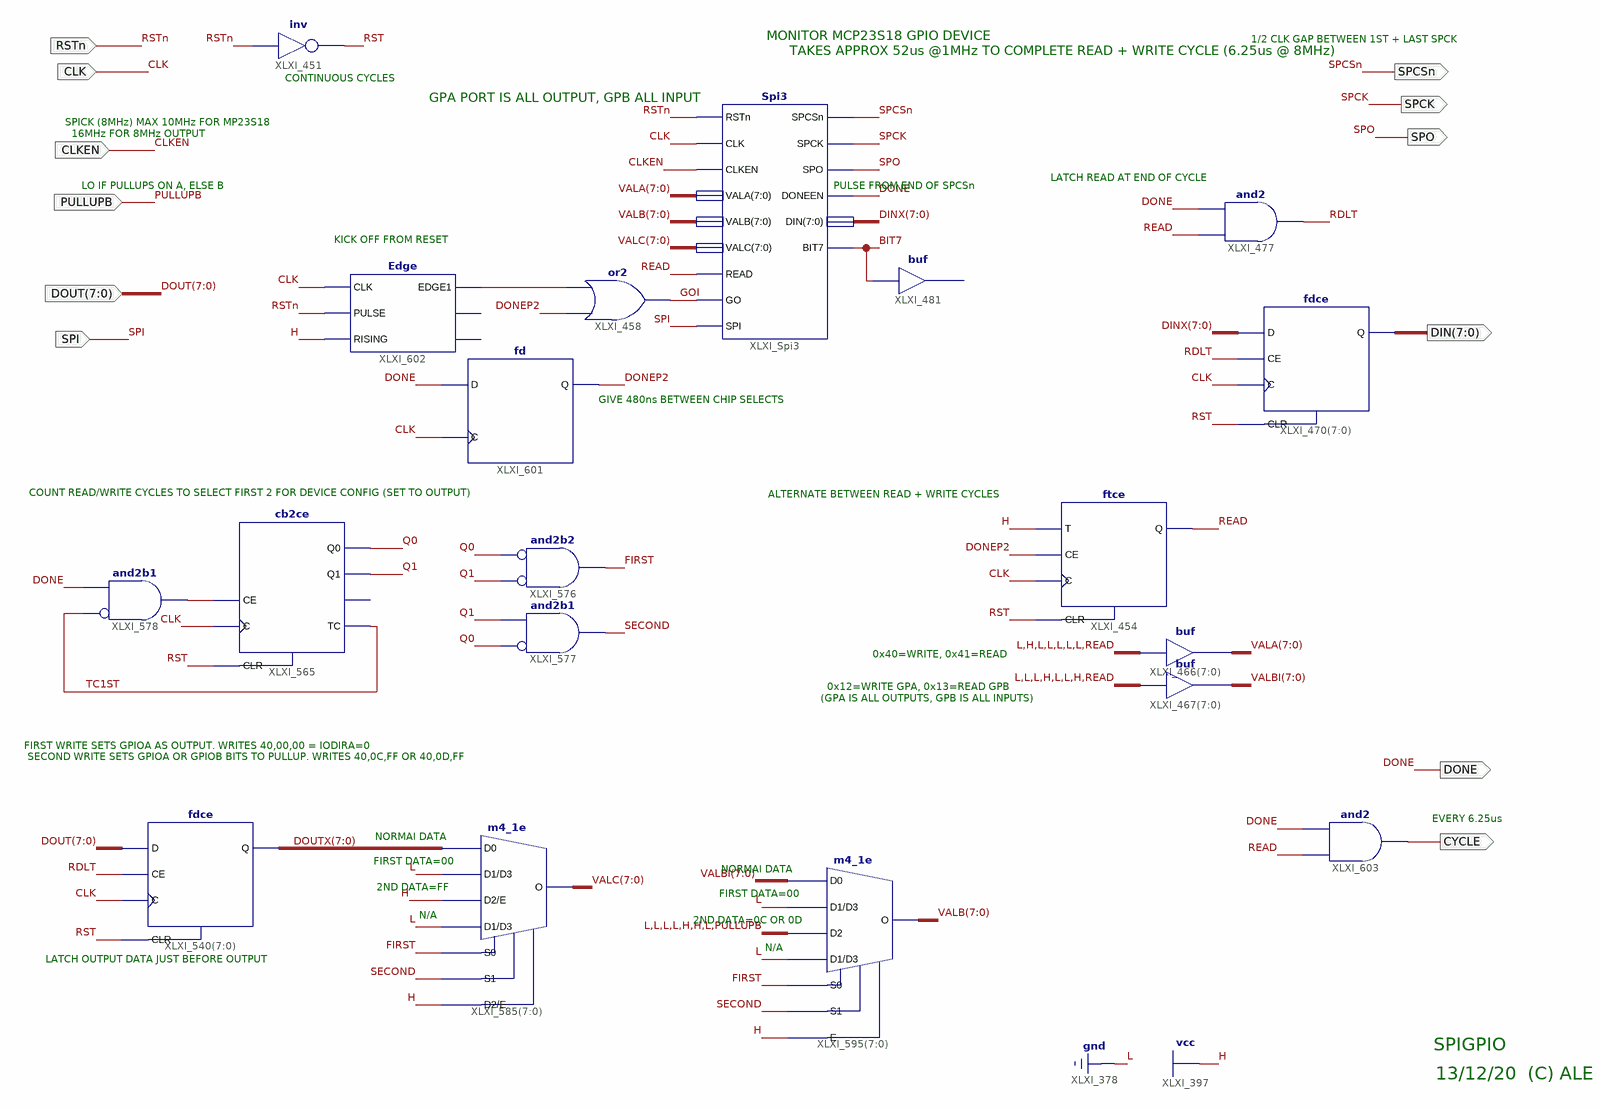
[diagram p0: schematic sheet 1]
// Xilinx ISE schematic SpiGpio.sch (spartan3e) as structural Verilog: 19 symbols, 12 ports
module SpiGpio (
  input  RSTn,
  input  CLK,
  input  [7:0] DOUT,
  input  SPI,
  input  CLKEN,
  input  PULLUPB,
  output SPCK,
  output SPO,
  output SPCSn,
  output DONE,
  output [7:0] DIN,
  output CYCLE
);

  wire BIT7, DONEP2, FIRST, GOI, Q0, Q1, RDLT, READ, RST, SECOND, TC1ST, XLXN_268, XLXN_355;
  wire [7:0] DINX, DOUTX, VALA, VALB, VALBI, VALC;

  not XLXI_451 (RST, RSTn);
  // buf XLXI_481 has open pins: I=BIT7, O=open
  fdce XLXI_470[7:0] (.C(CLK), .CE(RDLT), .CLR(RST), .D(DINX), .Q(DIN));
  and XLXI_477 (RDLT, READ, DONE);
  ftce XLXI_454 (.C(CLK), .CE(DONEP2), .CLR(RST), .T(1'b1), .Q(READ));
  assign VALA = {7'b0100000, READ};  // buf XLXI_466[7..0], 8 bits wide
  assign VALBI = {7'b0001001, READ};  // buf XLXI_467[7..0], 8 bits wide
  cb2ce XLXI_565 (.C(CLK), .CE(XLXN_355), .CLR(RST), .Q0(Q0), .Q1(Q1), .TC(TC1ST));  // open: CEO
  and XLXI_578 (XLXN_355, ~TC1ST, DONE);  // and2b1
  and XLXI_576 (FIRST, ~Q1, ~Q0);  // and2b2
  and XLXI_577 (SECOND, ~Q0, Q1);  // and2b1
  fdce XLXI_540[7:0] (.C(CLK), .CE(RDLT), .CLR(RST), .D(DOUT), .Q(DOUTX));
  m4_1e XLXI_585[7:0] (.D0(DOUTX), .D1(1'b0), .D2(1'b1), .D3(1'b0), .E(1'b1), .S0(FIRST), .S1(SECOND), .O(VALC));
  m4_1e XLXI_595[7:0] (
    .D0(VALBI), .D1(1'b0), .D2({7'b0000110, PULLUPB}), .D3(1'b0), .E(1'b1), .S0(FIRST), .S1(SECOND), .O(VALB));
  Spi3 XLXI_Spi3 (
    .BIT7(BIT7), .CLK(CLK), .CLKEN(CLKEN), .DIN(DINX), .DONEEN(DONE), .GO(GOI), .READ(READ), .RSTn(RSTn),
    .SPCK(SPCK), .SPCSn(SPCSn), .SPI(SPI), .SPO(SPO), .VALA(VALA), .VALB(VALB), .VALC(VALC));
  or XLXI_458 (GOI, DONEP2, XLXN_268);
  fd XLXI_601 (.C(CLK), .D(DONE), .Q(DONEP2));
  Edge XLXI_602 (.CLK(CLK), .EDGE1(XLXN_268), .PULSE(RSTn), .RISING(1'b1));  // open: EDGE0, EDGEQUICK
  and XLXI_603 (CYCLE, READ, DONE);

  // Notes on the sheet:
  //   MONITOR MCP23S18 GPIO DEVICE
  //   1/2 CLK GAP BETWEEN 1ST + LAST SPCK
  //   TAKES APPROX 52us @1MHz TO COMPLETE READ + WRITE CYCLE (6.25us @ 8MHz)
  //   CONTINUOUS CYCLES
  //   GPA PORT IS ALL OUTPUT, GPB ALL INPUT
  //   SPICK (8MHz) MAX 10MHz FOR MP23S18
  //   16MHz FOR 8MHz OUTPUT
  //   LATCH READ AT END OF CYCLE
  //   LO IF PULLUPS ON A, ELSE B
  //   PULSE FROM END OF SPCSn
  //   KICK OFF FROM RESET
  //   GIVE 480ns BETWEEN CHIP SELECTS
  //   COUNT READ/WRITE CYCLES TO SELECT FIRST 2 FOR DEVICE CONFIG (SET TO OUTPUT)
  //   ALTERNATE BETWEEN READ + WRITE CYCLES
  //   0x40=WRITE, 0x41=READ
  //   0x12=WRITE GPA, 0x13=READ GPB
  //   (GPA IS ALL OUTPUTS, GPB IS ALL INPUTS)
  //   FIRST WRITE SETS GPIOA AS OUTPUT. WRITES 40,00,00 = IODIRA=0
  //   SECOND WRITE SETS GPIOA OR GPIOB BITS TO PULLUP. WRITES 40,0C,FF OR 40,0D,FF
  //   EVERY 6.25us
  //   NORMAl DATA
  //   FIRST DATA=00
  //   NORMAl DATA
  //   2ND DATA=FF
  //   FIRST DATA=00
  //   N/A
  //   2ND DATA=0C OR 0D
  //   N/A
  //   LATCH OUTPUT DATA JUST BEFORE OUTPUT
  //   SPIGPIO
  //   13/12/20  (C) ALE
endmodule
